# EAGLE design Powerboard (EAGLE 9.6.2)
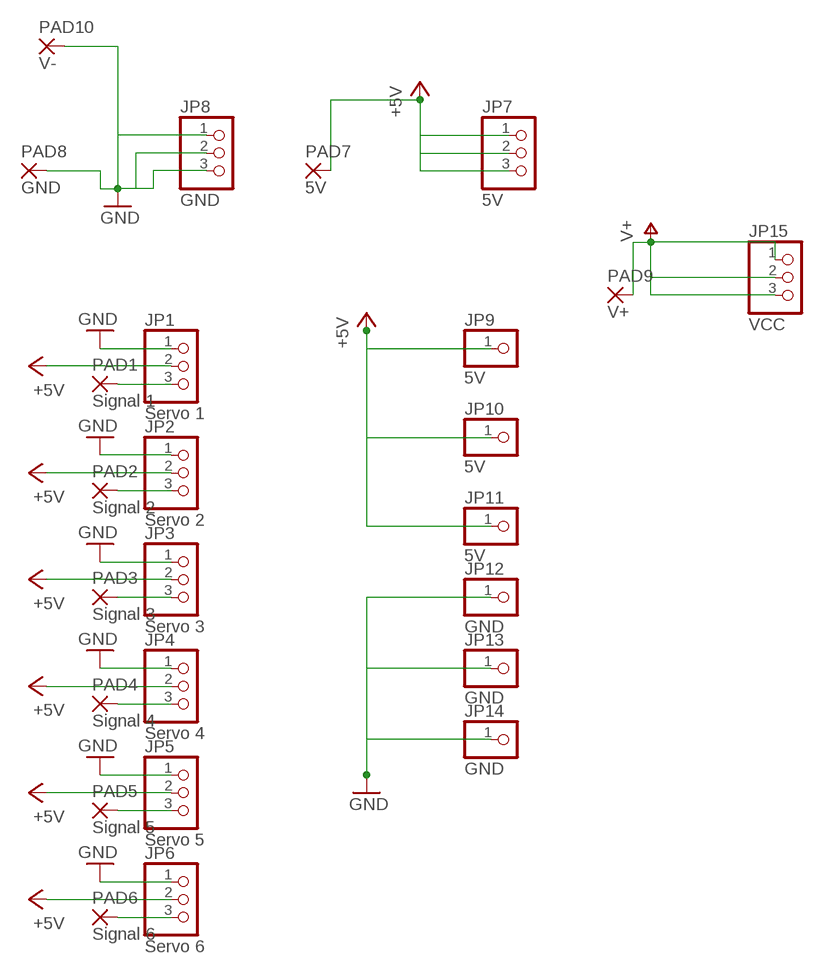
[diagram p0: schematic, sheet 1]

## Parts
JP1  Servo 1  PINHD-1X3  [1X03]
JP2  Servo 2  PINHD-1X3  [1X03]
JP3  Servo 3  PINHD-1X3  [1X03]
JP4  Servo 4  PINHD-1X3  [1X03]
JP5  Servo 5  PINHD-1X3  [1X03]
JP6  Servo 6  PINHD-1X3  [1X03]
JP7  5V  PINHD-1X3  [1X03]
JP8  GND  PINHD-1X3  [1X03]
JP9  5V  PINHD-1X1  [1X01]
JP10  5V  PINHD-1X1  [1X01]
JP11  5V  PINHD-1X1  [1X01]
JP12  GND  PINHD-1X1  [1X01]
JP13  GND  PINHD-1X1  [1X01]
JP14  GND  PINHD-1X1  [1X01]
JP15  VCC  PINHD-1X3  [1X03]
PAD1  Signal 1  3,81/1,4  [3,81/1,4]
PAD2  Signal 2  3,81/1,4  [3,81/1,4]
PAD3  Signal 3  3,81/1,4  [3,81/1,4]
PAD4  Signal 4  3,81/1,4  [3,81/1,4]
PAD5  Signal 5  3,81/1,4  [3,81/1,4]
PAD6  Signal 6  3,81/1,4  [3,81/1,4]
PAD7  5V  3,81/1,4  [3,81/1,4]
PAD8  GND  3,81/1,4  [3,81/1,4]
PAD9  V+  3,81/1,4  [3,81/1,4]
PAD10  V-  3,81/1,4  [3,81/1,4]

## Nets
+5V: JP1.2 JP2.2 JP3.2 JP4.2 JP5.2 JP6.2 JP7.1 JP7.2 JP7.3 JP9.1 JP10.1 JP11.1 PAD7.1(P)
GND: JP1.1 JP2.1 JP3.1 JP4.1 JP5.1 JP6.1 JP8.1 JP8.2 JP8.3 JP12.1 JP13.1 JP14.1 PAD8.1(P) PAD10.1(P)
N$1: JP1.3 PAD1.1(P)
N$2: JP2.3 PAD2.1(P)
N$3: JP3.3 PAD3.1(P)
N$4: JP4.3 PAD4.1(P)
N$5: JP5.3 PAD5.1(P)
N$6: JP6.3 PAD6.1(P)
V+: JP15.1 JP15.2 JP15.3 PAD9.1(P)

## Library data of the parts
JP1-JP8 JP15 = pinhead:PINHD-1X3: PIN HEADER
JP9-JP14 = pinhead:PINHD-1X1: PIN HEADER
PAD1-PAD10 = wirepad:3,81/1,4: THROUGH-HOLE PAD

## Net classes
0 default: width 1.016 mm, drill 0.508 mm, clearance 0.254 mm

## Board
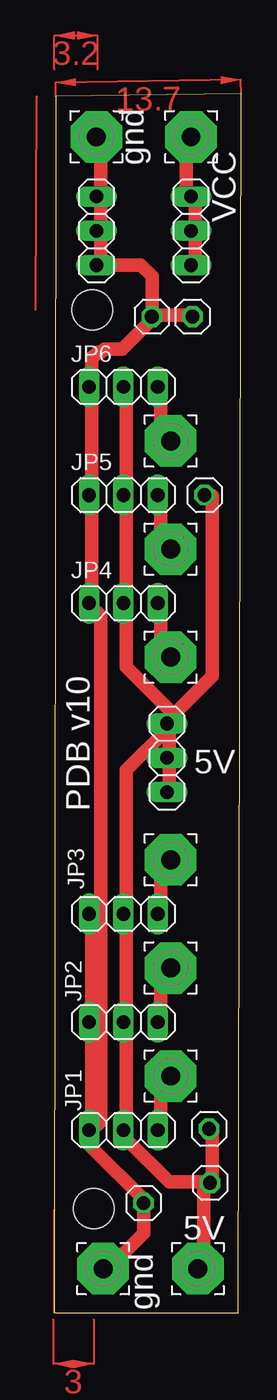
[diagram p1: board, top side]

Size 13.8 x 90.2 mm. Coordinates in mm from the lower left corner, seen from the top.
Outline: 0,0 13.6,0 13.8,90.2 0.1,90 0,0
Copper layers (1*16): Top 0.035mm / dielectric 1.5mm / Bottom 0.035mm
Design rules "default": minimum track width 6mil, minimum drill 0.35mm, track to track 6mil, track to pad 6mil, pad to pad 6mil, via to via 6mil, smd to smd 6mil, copper to edge 40mil, drill to drill 6mil, minimum pad ring 10mil, minimum via ring 8mil, stop-mask expansion 4mil, vias tented up to drill 0mil, thermal gap 10mil
Holes 3 mm at 2.8,74.2 2.9,7.7

### Footprints (pad centres in the part's own frame; a part is rotated, then mirrored left to right if it is on the bottom)
1X03 = drill 1.016 long: 1 -2.54,0; 2 0,0; 3 2.54,0
1X01 = drill 1.016 octagon: 1 0,0
3,81/1,4 = drill 1.397 pad 3.81 octagon: 1 0,0

### Placement (x,y rotation side)
JP1  5.1,13.5 0 top
JP2  5.1,21.5 0 top
JP3  5.1,29.5 0 top
JP4  5.1,52.5 0 top
JP5  5.1,60.5 0 top
JP6  5.1,68.5 0 top
JP7  8.32,41.05 90 top
JP8  3.1,80.05 90 top
JP9  11.43,13.6 0 top
JP10  11.1,60.5 0 top
JP11  11.51,9.6 0 top
JP12  7.2,73.7 0 top
JP13  10.2,73.7 0 top
JP14  6.59,8.1 0 top
JP15  10.1,80.05 90 top
PAD1  8.6,17.5 0 top
PAD2  8.6,25.5 0 top
PAD3  8.6,33.5 0 top
PAD4  8.6,48.5 0 top
PAD5  8.6,56.5 0 top
PAD6  8.6,64.5 0 top
PAD7  10.6,3.25 0 top
PAD8  3.6,3.25 0 top
PAD9  10.1,87 0 top
PAD10  3.1,87 0 top

### Tracks (layer width: path | path; a pad name or v marks a point on that pad's centre or on a via)
+5V
  Top 1.016: JP6.2 5.31,68.08 5.31,61.09 JP5.2 5.31,60.46 5.31,52.84 JP4.2 5.31,52.2 5.31,47.76 8.81,44.27 | JP7.1 8.49,38.87 8.49,40.77 JP7.2 8.49,41.41 8.49,43.31 | 8.81,44.27 8.49,43.95 JP7.3 8.49,43.31 | 8.81,44.27 11.66,47.12 11.66,60.46 JP10.1 | JP11.1 11.66,9.66 11.66,13.47 JP9.1 | JP11.1 11.03,9.03 11.03,3.31 PAD7.1 | JP11.1 11.03,9.66 8.49,9.66 5.31,12.84 5.31,13.47 JP1.2 5.31,14.11 5.31,21.09 JP2.2 5.31,21.73 5.31,29.34 JP3.2 5.31,29.98 5.31,40.14 8.49,43.31
GND
  Top 1.016: PAD8.1 4.04,3.31 6.58,5.85 6.58,7.76 JP14.1 6.58,8.39 2.77,12.2 2.77,13.47 | JP3.1 2.77,29.34 2.77,21.73 JP2.1 2.77,21.09 2.77,14.11 JP1.1 2.77,13.47 | 7.22,73.8 9.76,73.8 JP13.1 | 7.22,73.8 JP12.1 | PAD10.1 3.41,86.5 3.41,82.69 JP8.3 3.41,82.05 3.41,80.14 JP8.2 3.41,79.51 3.41,77.61 JP8.1 6.39,77.51 7.22,76.68 7.22,73.8 | 2.77,13.47 3.41,14.11 3.41,51.57 2.77,52.2 JP4.1 2.77,52.84 2.77,60.46 JP5.1 2.77,61.09 2.77,68.08 JP6.1 2.77,68.72 2.77,70.62 3.23,71.08 3.45,71.08 3.68,71.3 5,71.3 7.22,73.52 7.22,73.8
N$1
  Top 1.016: JP1.3 7.86,14.11 7.86,16.64 8.49,17.28 PAD1.1
N$2
  Top 1.016: JP2.3 7.86,21.73 7.86,24.27 8.49,24.9 PAD2.1
N$3
  Top 1.016: JP3.3 7.86,29.98 7.86,32.52 8.49,33.16 PAD3.1
N$4
  Top 1.016: JP4.3 7.86,52.2 7.86,49.66 8.49,49.03 PAD4.1
N$5
  Top 1.016: JP5.3 7.86,60.46 7.86,57.28 8.49,56.65 PAD5.1
N$6
  Top 1.016: JP6.3 7.86,68.08 7.86,65.54 8.49,64.91 PAD6.1
V+
  Top 1.016: JP15.1 10.39,77.61 10.39,79.51 JP15.2 10.39,80.14 10.39,82.05 JP15.3 9.76,82.69 9.76,86.5 PAD9.1
(copper drawn outside any net)
  shapes: Top area x5

### Text on the board
tNames: gnd | VCC | 5V | PDB v10 | 5V | gnd